# EAGLE design lightswitchx1 (EAGLE 7.6.0)
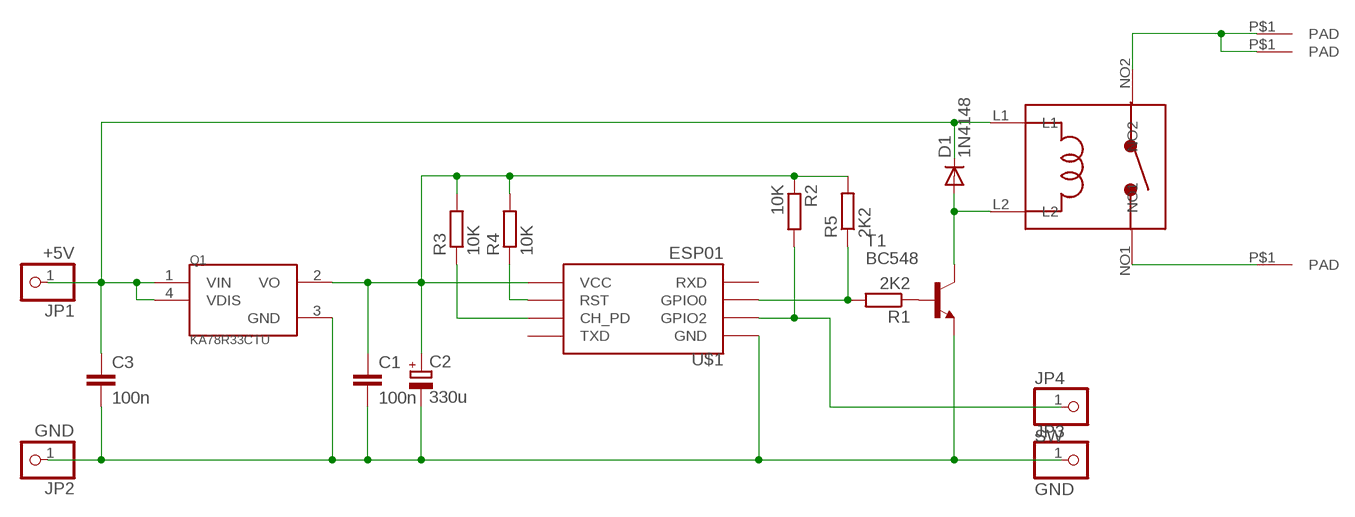
[diagram p0: schematic, sheet 1]

## Parts
C1  100n  C-EU025-030X050  [C025-030X050]
C2  330u  CPOL-EUE2-5  [E2-5]
C3  100n  C-EU025-030X050  [C025-030X050]
D1  1N4148  1N4148DO35-7  [DO35-7]
JP1  +5V  PINHD-1X1  [1X01]
JP2  GND  PINHD-1X1  [1X01]
JP3  GND  PINHD-1X1  [1X01]
JP4  SW  PINHD-1X1  [1X01]
Q1  KA78R33CTU  [TO-220-4]
R1  2K2  R-EU_0207/10  [0207/10]
R2  10K  R-EU_0207/10  [0207/10]
R3  10K  R-EU_0207/10  [0207/10]
R4  10K  R-EU_0207/10  [0207/10]
R5  2K2  R-EU_0207/10  [0207/10]
T1  BC548  BC547  [TO92]
U$1  ESP01  [ESP01]
U$2  LEG1A-5  [LEG-1A-5]
U$3  PAD  [PAD]
U$4  PAD  [PAD]
U$5  PAD  [PAD]

## Nets
N$1: JP4.1 R2.2 U$1.GPIO2
N$2: C1.2 C2.- C3.2 JP2.1 JP3.1 Q1.3(GND) T1.1(E) U$1.GND
N$3: C1.1 C2.+ Q1.2(VO) R2.1 R3.2 R4.2 R5.2 U$1.VCC
N$4: D1.A T1.3(C) U$2.L2
N$5: C3.1 D1.C JP1.1 Q1.1(VIN) Q1.4(VDIS) U$2.L1
N$6: R1.2 R5.1 U$1.GPIO0
N$7: R1.1 T1.2(B)
N$8: R4.1 U$1.RST
N$9: R3.1 U$1.CH_PD
N$10: U$2.NO2 U$3.P$1(PAD) U$5.P$1(PAD)
N$11: U$2.NO1 U$4.P$1(PAD)
Unconnected: U$1.RX(RXD) U$1.TX(TXD)

## Library data of the parts
C1 C3 = rcl:C-EU: CAPACITOR, European symbol
C2 = rcl:CPOL-EU: POLARIZED CAPACITOR, European symbol
D1 = diode:1N4148: DIODE high speed (Philips)
JP1-JP4 = adafruit:PINHD-1X1: Pin header 1x1 for 0.1" spacing With round pins
Q1 = KA78R33CTU:KA78R33CTU: KA78R Series 3.3 V Fixed Output 1 A LDO Voltage Regulator - TO-220F-4L; AVAILABILITY: Good; DESCRIPTION: KA78R Series 3.3 V Fixed Output 1 A LDO Voltage Regulator - TO-220F-4L; MF: Fairchild Semiconductor; MP: KA78R33CTU; PACKAGE: TO-220 Fairchild Semiconductor; PRICE: 0.55 USD
R1-R5 = rcl:R-EU_: RESISTOR, European symbol
T1 = transistor:BC547: NPN TRANSISTOR
U$1 = esp8266modules:ESP01: ESP8266 Wifi module 01
U$2 = LEG-1A-5:LEG1A-5
U$3-U$5 = LEG-1A-5:PAD

## Board
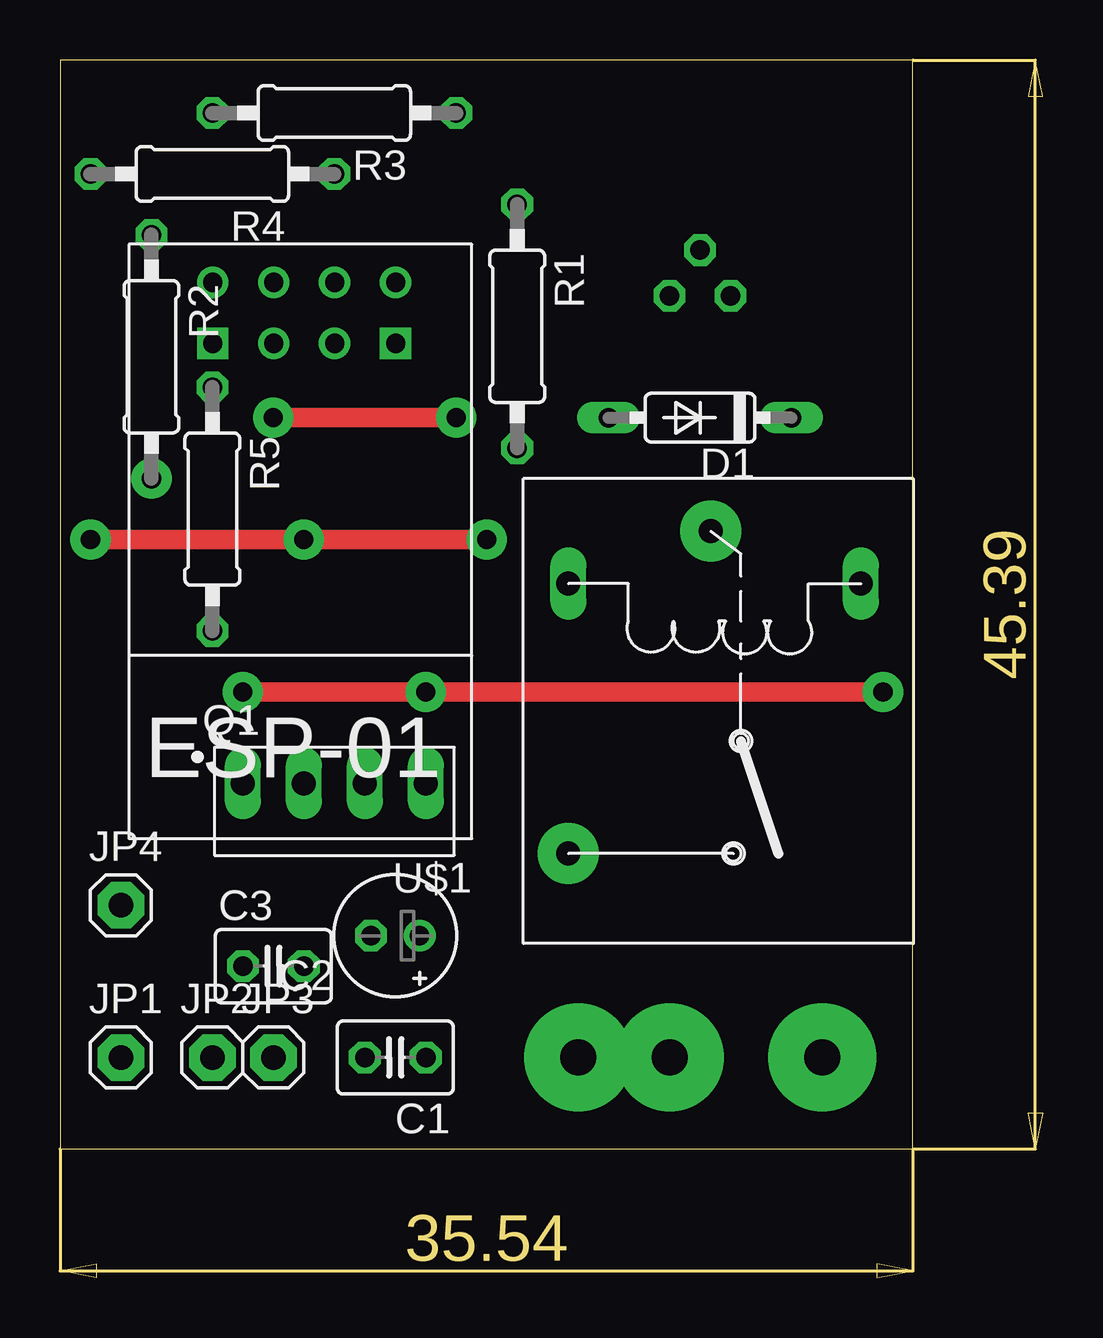
[diagram p1: board, top side]
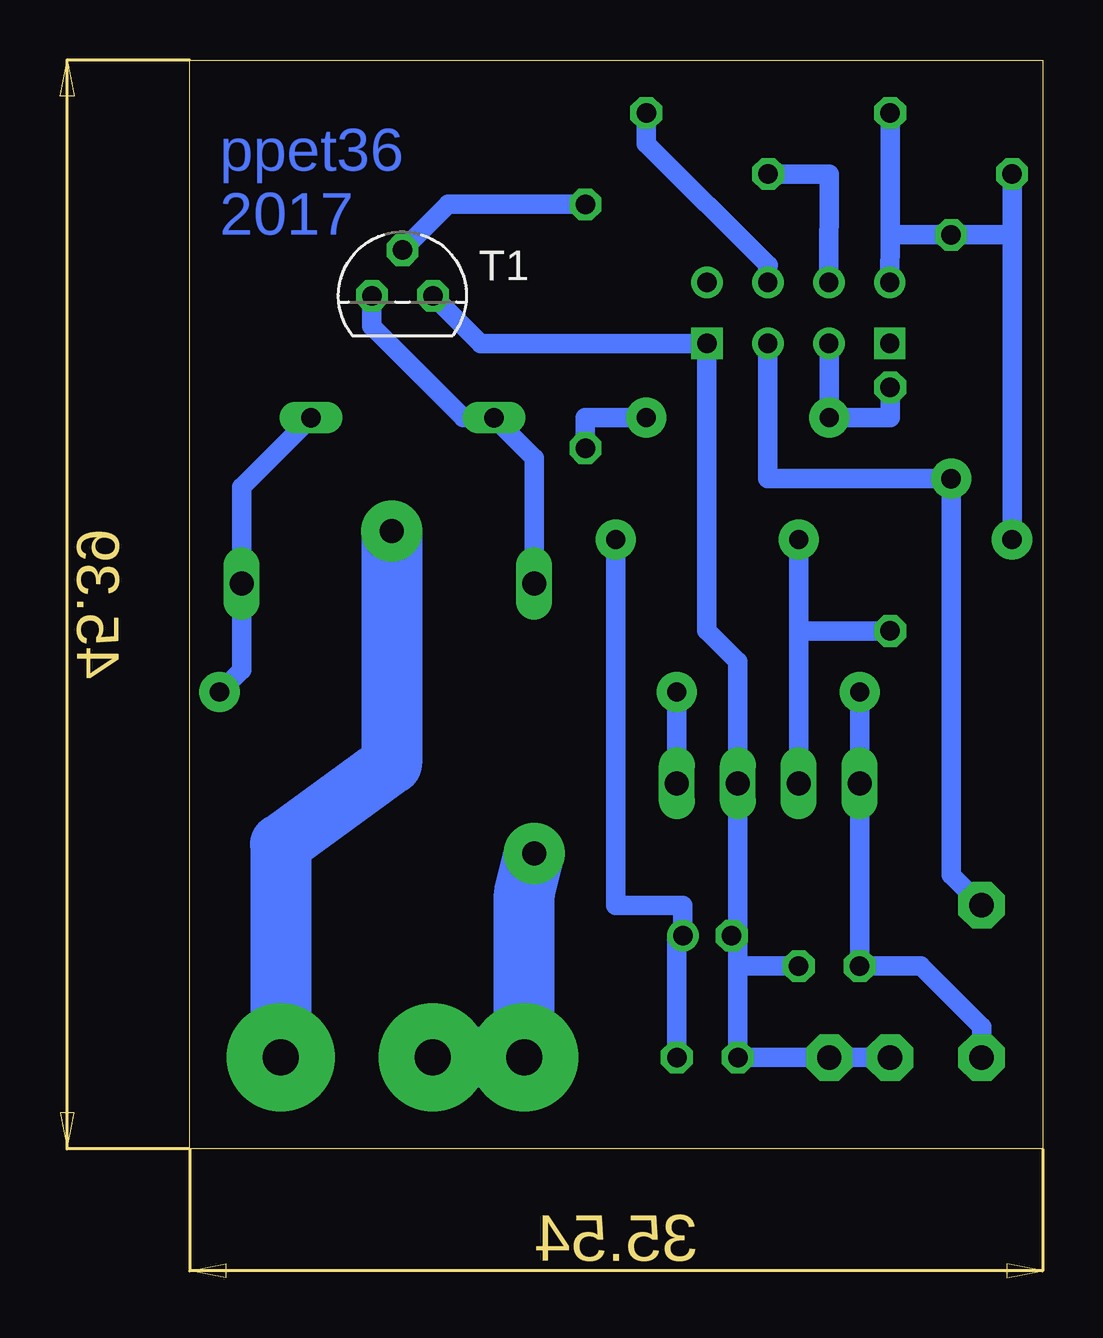
[diagram p2: board, bottom side, seen from below]

Size 35.54 x 45.39 mm. Coordinates in mm from the lower left corner, seen from the top.
Outline: 0,0 35.54,0 35.54,45.39 0,45.39 0,0
Copper layers (1*16): Top 0.035mm / dielectric 1.5mm / Bottom 0.035mm
Design rules "default": minimum track width 10mil, minimum drill 24mil, track to track 8mil, track to pad 8mil, pad to pad 8mil, via to via 8mil, smd to smd 8mil, copper to edge 40mil, drill to drill 8mil, minimum pad ring 10mil, minimum via ring 8mil, stop-mask expansion 4mil, vias tented up to drill 0mil, thermal gap 10mil

### Footprints (pad centres in the part's own frame; a part is rotated, then mirrored left to right if it is on the bottom)
C025-030X050 = drill 0.813 octagon: 1 -1.27,0; 2 1.27,0
E2-5 = drill 0.813 pad 1.27: + -1.016,0 | drill 0.813 pad 1.27 octagon: - 1.016,0
DO35-7 = drill 0.813 long: A 3.81,0; C -3.81,0
1X01 = drill 1.016 pad 1.93 octagon: 1 0,0
TO-220-4 = drill 1 long: 1 -3.81,0; 2 -1.27,0; 3 1.27,0; 4 3.81,0
0207/10 = drill 0.813 octagon: 1 -5.08,0; 2 5.08,0
TO92 = drill 0.813 octagon: 1 1.27,0; 2 0,1.905; 3 -1.27,0
ESP01 = drill 0.8: CH_PD -1.285,-8.178; GPIO0 1.255,-5.638; GPIO2 -1.285,-5.638; RST 1.255,-8.178; TX -3.825,-8.178; VCC 3.795,-8.178 | drill 0.8 square: GND -3.825,-5.638; RX 3.795,-5.638
LEG-1A-5 = drill 1 long: L1 2.188,4.375; L2 14.375,4.375 | drill 1 pad 2.54: NO1 8.438,2.188; NO2 14.375,15.625
PAD = drill 1.5 pad 4.5: P$1 0,0

### Placement (x,y rotation side)
C1  13.97,3.81 180 top
C2  13.97,8.89 180 top
C3  8.89,7.62 0 top
D1  26.67,30.48 180 top
JP1  2.54,3.81 0 top
JP2  6.35,3.81 0 top
JP3  8.89,3.81 0 top
JP4  2.54,10.16 0 top
Q1  11.43,15.24 0 top
R1  19.05,34.29 270 top
R2  3.81,33.02 270 top
R3  11.43,43.18 180 top
R4  6.35,40.64 180 top
R5  6.35,26.67 270 top
T1  26.67,35.56 0 bottom
U$1  10.16,27.94 180 top
U$2  35.56,27.94 180 top
U$3  21.59,3.81 0 top
U$4  31.75,3.81 0 top
U$5  25.4,3.81 0 top

### Tracks (layer width: path | path; a pad name or v marks a point on that pad's centre or on a via)
N$1  (via drill 0.8 pad 1.68)
  Bottom 0.813: U$1.GPIO2 11.45,27.94 R2.2 3.81,11.43 JP4.1
  other vias: 3.81,27.94
N$2
  Bottom 0.813: 12.7,8.89 12.7,7.62 | 12.7,7.62 C1.2 JP3.1 JP2.1 | C3.2 12.7,7.62 | C2.- 12.7,8.89 | 12.7,8.89 Q1.3 12.7,20.32 13.98,21.61 U$1.GND 23.42,33.58 T1.1
N$3  (via drill 0.8 pad 1.68)
  Top 0.813: v1.27,25.4 v10.16,25.4 v17.78,25.4
  Bottom 0.813: C1.1 15.24,8.89 C2.+ 14.99,10.16 17.78,10.16 v17.78,25.4 | U$1.VCC 6.35,38.1 | 6.35,38.1 R2.1 1.27,38.1 | v1.27,25.4 1.27,38.1 | 1.27,38.1 R4.2 | R3.2 6.35,38.1 | Q1.2 10.16,21.59 | 10.16,21.59 v10.16,25.4 | R5.2 10.16,21.59
N$4
  Bottom 0.813: U$2.L2 21.18,28.8 D1.A 24.13,30.48 27.94,34.29 T1.3
N$5  (via drill 0.8 pad 1.68)
  Top 0.813: v7.62,19.05 v15.24,19.05 v34.29,19.05
  Bottom 0.813: v7.62,19.05 Q1.1 C3.1 5.08,7.62 2.54,5.08 JP1.1 | D1.C 33.37,27.59 U$2.L1 33.37,19.97 v34.29,19.05 | Q1.4 v15.24,19.05
N$6  (via drill 0.8 pad 1.68)
  Top 0.813: v16.51,30.48 v8.89,30.48
  Bottom 0.813: U$1.GPIO0 8.89,33.56 v8.89,30.48 6.35,30.48 R5.1 | R1.2 19.05,30.48 v16.51,30.48
N$7
  Bottom 0.813: R1.1 24.77,39.37 T1.2
N$8
  Bottom 0.813: U$1.RST 8.89,40.64 R4.1
N$9
  Bottom 0.813: U$1.CH_PD 11.45,36.81 11.43,36.83 16.51,41.91 R3.1
N$10
  Bottom 2.54: U$2.NO2 21.59,10.64 U$3.P$1 U$5.P$1
N$11
  Bottom 2.54: U$2.NO1 27.12,16.06 31.75,12.7 U$4.P$1

### Text on the board
Bottom: ppet36 / 2017